# Altium schematic sheet DIN-rail AC-DC 24V.SchDoc
size A4; SheetNumber: 1; SheetTotal: 1
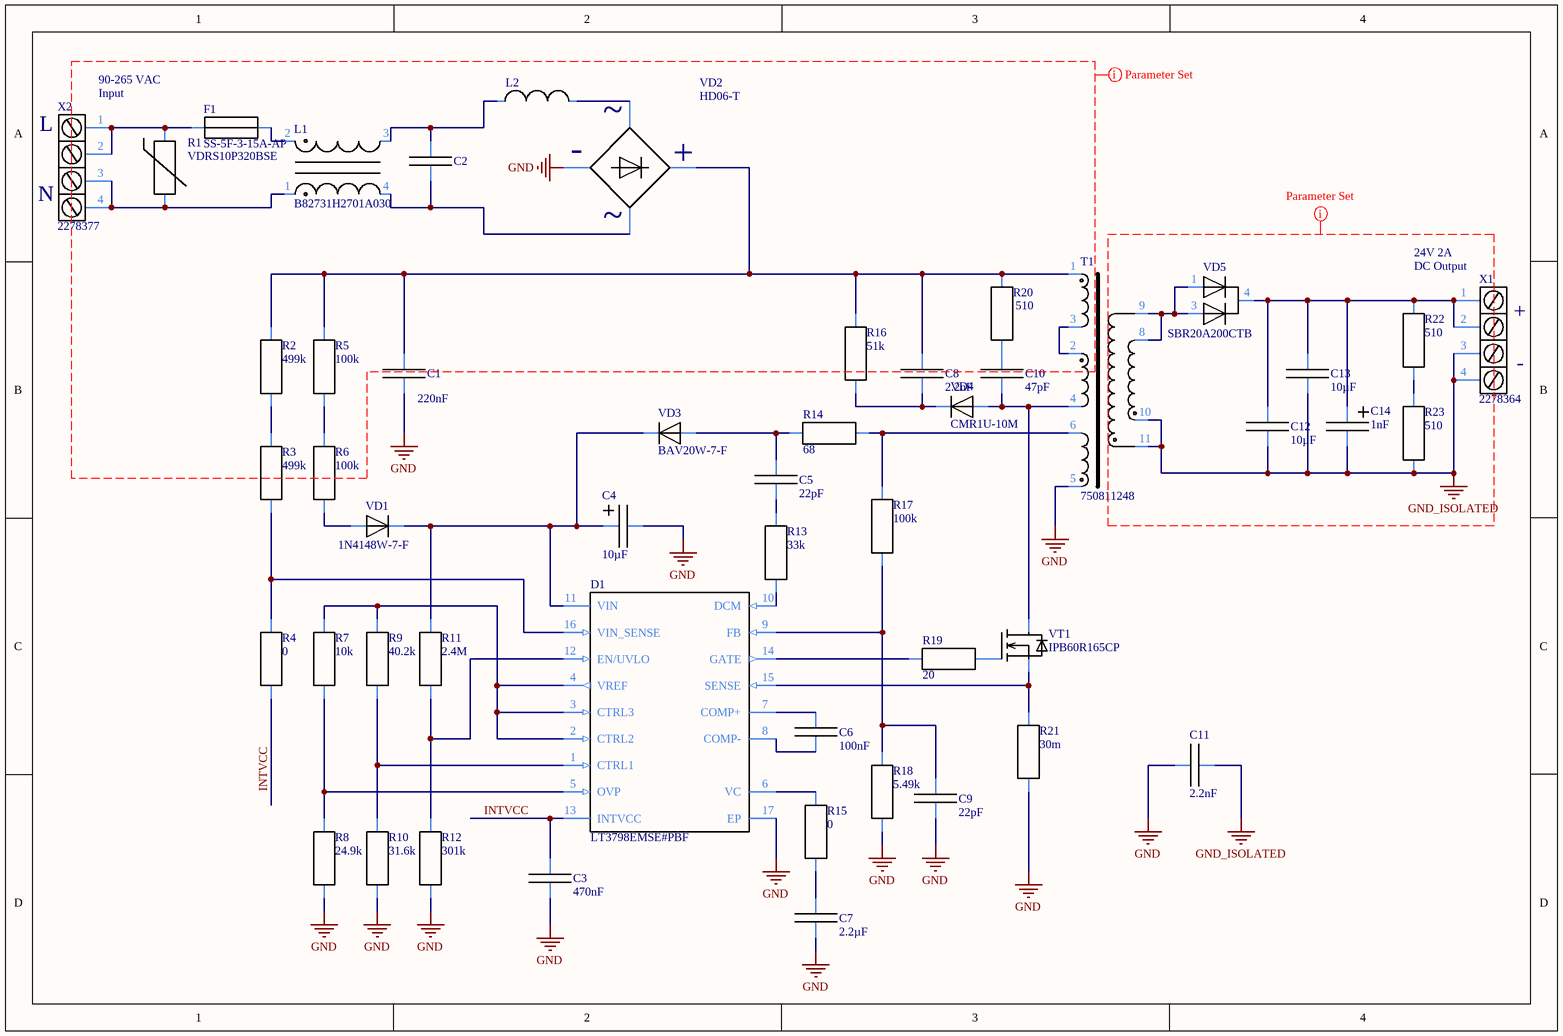
[diagram p0: DIN-rail AC-DC 24V.SchDoc]

## Parts
C1  Capacitance: 220nF  [ECQE4224XF]  (hidden comment: ECQE4224KF)
C2  ECQUAAF104M  [ECUAAF104]  (value not drawn)
C3  Capacitance: 470nF  [C0805]  (hidden comment: 0805YD475MAT2A)
C4  Capacitance: 10µF  [CAPPRD200W60D500H1100]  (hidden comment: 50YXJ10M5X11)
C5  Capacitance: 22pF  [C0805]  (hidden comment: 08055A220CAT2A)
C6  Capacitance: 100nF  [C0805]  (hidden comment: C2012X7R1H104K)
C7  Capacitance: 2.2µF  [C0805]  (hidden comment: C2012X5R1H225K)
C8  Capacitance: 2.2nF  [C1210]  (hidden comment: GRM32A7U2J222JW31D)
C9  Capacitance: 22pF  [C0805]  (hidden comment: 08055A220CAT2A)
C10  Capacitance: 47pF  [C1206]  (hidden comment: 1206CA470KAT1A)
C11  Capacitance: 2.2nF  [40LD22]  (hidden comment: 440LD22-R)
C12  Capacitance: 10µF  [C1210]  (hidden comment: GRM32ER7YA106KA12L)
C13  Capacitance: 10µF  [C1210]  (hidden comment: GRM32ER7YA106KA12L)
C14  Capacitance: 1nF  [CAPPRD500W60D1250H3000_1]  (hidden comment: ELXY350ETD102MK30S)
D1  LT3798EMSE#PBF  [SOP17P50_403X490X110L53X22T284X165]
F1  SS-5F-3-15A-AP  [SS-5F]
L1  B82731H2701A030  [B82731H]
L2  TSL1315RA-102JR78-PF  [TSL1315]  (value not drawn)
R1  VDRS10P320BSE  [VDRS10P320]
R2  Resistance: 499k  [R1206]  (hidden comment: CRCW1206499KFKEA)
R3  Resistance: 499k  [R1206]  (hidden comment: CRCW1206499KFKEA)
R4  Resistance: 0  [R0805]  (hidden comment: CRCW08050000Z0EA)
R5  Resistance: 100k  [R1206]  (hidden comment: CRCW1206100KFKEA)
R6  Resistance: 100k  [R1206]  (hidden comment: CRCW1206100KFKEA)
R7  Resistance: 10k  [R0805]  (hidden comment: CRCW080510K0FKEA)
R8  Resistance: 24.9k  [R0805]  (hidden comment: CRCW080524K9FKEA)
R9  Resistance: 40.2k  [R0805]  (hidden comment: CRCW080540K2FKEA)
R10  Resistance: 31.6k  [R0805]  (hidden comment: CRCW080531K6FKEA)
R11  Resistance: 2.4M  [R0805]  (hidden comment: CRCW08052M40JNEA)
R12  Resistance: 301k  [R0805]  (hidden comment: CRCW0805301KFKEA)
R13  Resistance: 33k  [R0805]  (hidden comment: CRCW080533K0JNEA)
R14  Resistance: 68  [R0805]  (hidden comment: CRCW080568R0FKEA)
R15  Resistance: 0  [R0805]  (hidden comment: CRCW08050000Z0EA)
R16  Resistance: 51k  [R1210]  (hidden comment: CRCW121051K0JNEA)
R17  Resistance: 100k  [R0805]  (hidden comment: CRCW0805100KFKEA)
R18  Resistance: 5.49k  [R0805]  (hidden comment: CRCW08055K49FKEA)
R19  Resistance: 20  [R0805]  (hidden comment: CRCW080520R0FKEA)
R20  Resistance: 510  [R1210]  (hidden comment: CRCW1210510RJNEA)
R21  Resistance: 30m  [R1206]  (hidden comment: WSL1206R0300FEA)
R22  Resistance: 510  [R1210]  (hidden comment: CRCW1210510RJNEA)
R23  Resistance: 510  [R1210]  (hidden comment: CRCW1210510RJNEA)
T1  750811248  [750811248]
VD1  1N4148W-7-F  [SOD-123]
VD2  HD06-T  [SOIC250P600X300-4L]
VD3  BAV20W-7-F  [SOD-123]
VD4  CMR1U-10M  [SMA]
VD5  SBR20A200CTB  [D2PAK]
VT1  IPB60R165CP  [D2PAK]
X1  2278364  [MCO 1,5_4-G1L-3,5 KMGY]
X2  2278377  [MCO 1,5_4-G1R-3,5 KMGY]

## Nets
GND: C1.2 C3.1 C4.2 C7.1 C9.2 C11.1 D1.17(EP) R8.1 R10.1 R12.1 R18.2 R21.1 T1.5 VD2.2
GND_ISOLATED: C11.2 C12.1 C13.1 C14.2 R23.1 T1.10 T1.11 X1.3 X1.4
INTVCC: C3.2 D1.13(INTVCC) R4.2
NetC1_1: C1.1 C8.2 R2.1 R5.1 R16.2 R20.2 T1.1 VD2.1
NetC2_1: C2.1 L1.4 VD2.4
NetC2_2: C2.2 L1.3 L2.1
NetC4_1: C4.1 D1.11(VIN) R11.2 VD1.2 VD3.2
NetC5_1: C5.1 R13.2
NetC5_2: C5.2 R14.1 VD3.1
NetC6_1: C6.1 D1.7(COMP+)
NetC6_2: C6.2 D1.8(COMP-)
NetC7_2: C7.2 R15.1
NetC8_1: C8.1 R16.1 VD4.2
NetC9_1: C9.1 D1.9(FB) R17.2 R18.1
NetC10_1: C10.1 T1.4 VD4.1 VT1.4
NetC10_2: C10.2 R20.1
NetC12_2: C12.2 C13.2 C14.1 R22.2 VD5.4 X1.1 X1.2
NetD1_1: D1.1(CTRL1) R9.1 R10.2
NetD1_2: D1.2(CTRL2) D1.3(CTRL3) D1.4(VREF) R7.2 R9.2
NetD1_5: D1.5(OVP) R7.1 R8.2
NetD1_6: D1.6(VC) R15.2
NetD1_10: D1.10(DCM) R13.1
NetD1_12: D1.12(EN/UVLO) R11.1 R12.2
NetD1_14: D1.14(GATE) R19.1
NetD1_15: D1.15(SENSE) R21.2 VT1.3
NetD1_16: D1.16(VIN_SENSE) R3.2 R4.1
NetF1_1: F1.1 R1.2 X2.1 X2.2
NetF1_2: F1.2 L1.2
NetL1_1: L1.1 R1.1 X2.3 X2.4
NetL2_2: L2.2 VD2.3
NetR2_2: R2.2 R3.1
NetR5_2: R5.2 R6.1
NetR6_2: R6.2 VD1.1
NetR14_2: R14.2 R17.1 T1.6
NetR19_2: R19.2 VT1.1
NetR22_1: R22.1 R23.2
NetT1_2: T1.2 T1.3
NetT1_8: T1.8 T1.9 VD5.1 VD5.3

## Layout directives
net class HV: GND
net class Secondary: GND_ISOLATED

## Notes on the sheet
- 90-265 VAC
- (near X2) Input
- (near X2) L
- (near X2) N
- 24V 2A
- DC Output
- (near X1) +
- (near X1) -
- (in symbol CMP-00022-2) ~; +

## Library data of the parts
C1 = CMP-00002-6: Film Capacitor, Polyester, 400V, 10% +Tol, 10% -Tol, 0.22uF, Through Hole Mount; Temp H: 105°C; Temp L: -40°C; Tolerance: 10%; Series: ECQE; Voltage: 400V; Dielectric: Polyester
C2 = CMP-00001-5: Film Capacitor, Polypropylene, 20% +Tol, 20% -Tol, 0.1uF, Through Hole Mount; Capacitance: 100nF; Temp L: -40°C; Voltage: 275V; Temp H: 110°C; Tolerance: 20%; Dielectric: Polypropylene; Series: ECQUA
C3 = CMP-00008-3: Ceramic Capacitor, Multilayer, Ceramic, 16V, 20% +Tol, 20% -Tol, X5R, 15% TC, 4.7uF, Surface Mount, 0805; Temp L: -55°C; Temp H: 85°C; Dielectric: X5R; Tolerance: 20%; Series: -; Voltage: 16V
C4 = CMP-00003-3: Aluminum Electrolytic Capacitor, Polarized, Aluminum (wet), 50V, 20% +Tol, 20% -Tol, 10uF, Through Hole Mount; Temp H: 105°C; Dielectric: Al oxide; Temp L: -40°C; Voltage: 50V; Series: YXJ; Tolerance: 20%
C5 C9 = CMP-00005-2: Ceramic Capacitor, Ceramic, 50V, 1.1364% +Tol, 1.1364% -Tol, C0G, -/+30ppm/Cel TC, 0.000022uF, 0805; Dielectric: NP0; Temp H: 125°C; Temp L: -55°C; Voltage: 50V; Series: -
C6 = CMP-00006-4: Ceramic Capacitor, Multilayer, Ceramic, 50V, 10% +Tol, 10% -Tol, X7R, 15% TC, 0.1uF, Surface Mount, 0805; Temp H: 125°C; Temp L: -55°C; Voltage: 50V; Series: C; Tolerance: 10%; Dielectric: X7R
C7 = CMP-00007-3: Cap Ceramic 2.2uF 50V X5R 10% SMD 0805 85C T/R; Temp H: 85°C; Temp L: -55°C; Voltage: 50V; Series: C; Tolerance: 10%; Dielectric: X5R
C8 = CMP-00000-3: Ceramic Capacitor, Multilayer, Ceramic, 630V, 5% +Tol, 5% -Tol, U2J, -750+/-120ppm/Cel TC, 0.0022uF, Surface Mount, 1210; Temp L: -55°C; Temp H: 125°C; Voltage: 630V; Dielectric: U2J; Series: GRM; Tolerance: 5%
C10 = CMP-00011-1: Ceramic Capacitor, Multilayer, Ceramic, 630V, 10% +Tol, 10% -Tol, C0G, 30ppm/Cel TC, 0.000047uF, Surface Mount, 1206; Dielectric: NP0; Temp L: -55°C; Temp H: 125°C; Tolerance: 10%; Voltage: 630V; Series: -
C11 = CMP-00004-1: Ceramic Capacitor, Ceramic, 20% +Tol, 20% -Tol, Y5U, -56/+22% TC, 0.0022uF, Through Hole Mount; Temp H: 125°C; Voltage: 760V; Temp L: -30°C; Dielectric: Y5U; Series: Cera-Mite 440L; Tolerance: 20%
C12 C13 = CMP-00010-1: Ceramic Capacitor, Multilayer, Ceramic, 35V, 10% +Tol, 10% -Tol, X7R, 15% TC, 10uF, Surface Mount, 1210; Temp L: -55°C; Tolerance: 20%; Temp H: 125°C; Dielectric: X7R; Series: GRM; Voltage: 35V
C14 = CMP-00009-4: Aluminum Electrolytic Capacitor, Polarized, Aluminum (wet), 35V, 20% +Tol, 20% -Tol, 1000uF, Through Hole Mount; Dielectric: Al oxide; Temp H: 105°C; Temp L: -55°C; Voltage: 35V; Tolerance: 20%; Series: LXY
D1 = CMP-00048-2: Power Factor Controller, Current-mode, 150kHz Switching Freq-Max, BIPolar, PDSO16; Temp L: 125°C; Temp H: -40°C
F1 = CMP-00049-1: Electric Fuse; Temp H: -40°C; Current: 3.15A; Temp L: 85°C; Series: SS-5F
L1 = CMP-00018-3: General Purpose Inductor, 27000uH, 50%, 2 Element, Ferrite-Core; Inductance: 27mH; Temp L: -40°C; Voltage: 250V; Current: 700mA; Temp H: 125°C; Series: B82731
L2 = CMP-00019-1: General Purpose Inductor, 1000uH, 5%, 1 Element; Temp H: 85°C; Current: 780mA; Temp L: -20°C; Inductance: 1mH; Tolerance: 5%; Series: TSL
R1 = CMP-00047-1: Varistor, 420V, 77J, Through Hole Mount; Current: 2.5kA; Energy: 77; Temp L: -40°C; Temp H: 85°C; Voltage: 510V; Series: VDRS
R2 R3 = CMP-00037-1: Fixed Resistor, Metal Glaze/thick Film, 0.25W, 499000ohm, 200V, 1% +/-Tol, 100ppm/Cel, Surface Mount, 1206; Temp L: -55°C; Temp Coeff: ±100ppm; Power: 250mW; Temp H: 155°C; Composition: Thik Film; Series: CRCW; Tolerance: 1%
R4 R15 = CMP-00040-1: Fixed Resistor, Metal Glaze/thick Film, 0.125W, 0ohm, Surface Mount, 0805; Power: 125mW; Temp L: -55°C; Temp H: 155°C; Tolerance: 0%; Temp Coeff: -; Composition: Thick Film; Series: CRCW
R5 R6 = CMP-00016-3: Fixed Resistor, Metal Glaze/thick Film, 0.25W, 100000ohm, 200V, 1% +/-Tol, 100ppm/Cel, Surface Mount, 1206; Temp L: -55°C; Temp Coeff: ±100ppm; Temp H: 155°C; Power: 250mW; Composition: Thik Film; Tolerance: 1%; Series: CRCW
R7 = CMP-00041-1: Fixed Resistor, Metal Glaze/thick Film, 0.125W, 10000ohm, 150V, 1% +/-Tol, 100ppm/Cel, Surface Mount, 0805; Temp Coeff: ±100ppm; Power: 125mW; Temp H: 155°C; Temp L: -55°C; Series: CRCW; Composition: Thick Film; Tolerance: 1%
R8 = CMP-00045-1: Fixed Resistor, Metal Glaze/thick Film, 0.125W, 24900ohm, 150V, 1% +/-Tol, 100ppm/Cel, Surface Mount, 0805; Power: 125mW; Temp L: -55°C; Temp Coeff: ±100ppm; Temp H: 155°C; Series: CRCW; Tolerance: 1%; Composition: Thick Film
R9 = CMP-00042-1: Fixed Resistor, Metal Glaze/thick Film, 0.125W, 40200ohm, 150V, 1% +/-Tol, 100ppm/Cel, Surface Mount, 0805; Temp L: -55°C; Power: 125mW; Temp Coeff: ±100ppm; Temp H: 155°C; Tolerance: 1%; Composition: Thick Film; Series: CRCW
R10 = CMP-00043-1: Fixed Resistor, Metal Glaze/thick Film, 0.125W, 31600ohm, 150V, 1% +/-Tol, 100ppm/Cel, Surface Mount, 0805; Power: 125mW; Temp H: 155°C; Temp Coeff: ±100ppm; Temp L: -55°C; Series: CRCW; Tolerance: 1%; Composition: Thick Film
R11 = CMP-00039-1: Fixed Resistor, Metal Glaze/thick Film, 0.125W, 2400000ohm, 150V, 5% +/-Tol, 200ppm/Cel, Surface Mount, 0805; Temp L: -55°C; Temp Coeff: ±200ppm; Temp H: 155°C; Power: 125mW; Tolerance: 5%; Composition: Thick Film; Series: CRCW
R12 = CMP-00044-1: Fixed Resistor, Metal Glaze/thick Film, 0.125W, 301000ohm, 150V, 1% +/-Tol, 100ppm/Cel, Surface Mount, 0805; Temp L: -55°C; Temp H: 155°C; Temp Coeff: ±100ppm; Power: 125mW; Tolerance: 1%; Series: CRCW; Composition: Thick Film
R13 = CMP-00033-1: Fixed Resistor, Metal Glaze/thick Film, 0.125W, 33000ohm, 150V, 5% +/-Tol, 200ppm/Cel, Surface Mount, 0805; Temp L: -55°C; Power: 125mW; Temp H: 155°C; Temp Coeff: ±200ppm; Composition: Thick Film; Tolerance: 5%; Series: CRCW
R14 = CMP-00030-1: Fixed Resistor, Metal Glaze/thick Film, 0.125W, 68ohm, 150V, 1% +/-Tol, 100ppm/Cel, Surface Mount, 0805; Temp L: -55°C; Temp H: 155°C; Temp Coeff: ±100ppm; Power: 125mW; Tolerance: 1%; Composition: Thick Film; Series: CRCW
R16 = CMP-00038-1: Fixed Resistor, Metal Glaze/thick Film, 0.5W, 51000ohm, 200V, 5% +/-Tol, 200ppm/Cel, Surface Mount, 1210; Temp H: 155°C; Temp Coeff: ±200ppm; Temp L: -55°C; Power: 500mW; Composition: Thik Film; Tolerance: 5%; Series: CRCW
R17 = CMP-00020-3: Fixed Resistor, Metal Glaze/thick Film, 0.25W, 100000ohm, 200V, 1% +/-Tol, 100ppm/Cel, Surface Mount, 1206; Temp Coeff: ±100ppm; Temp L: -55°C; Temp H: 155°C; Power: 125mW; Series: CRCW; Tolerance: 1%; Composition: Thik Film
R18 = CMP-00021-2: Fixed Resistor, Metal Glaze/thick Film, 0.125W, 5490ohm, 150V, 1% +/-Tol, 100ppm/Cel, Surface Mount, 0805; Temp L: -55°C; Temp H: 155°C; Temp Coeff: ±100ppm; Power: 125mW; Tolerance: 1%; Composition: Thick Film; Series: CRCW
R19 = CMP-00032-1: Fixed Resistor, Metal Glaze/thick Film, 0.125W, 20ohm, 150V, 1% +/-Tol, 100ppm/Cel, Surface Mount, 0805; Temp Coeff: ±100ppm; Power: 125mW; Temp L: -55°C; Temp H: 155°C; Series: CRCW; Tolerance: 1%; Composition: Thick Film
R20 R22 R23 = CMP-00035-1: Fixed Resistor, Metal Glaze/thick Film, 0.5W, 510ohm, 200V, 5% +/-Tol, 200ppm/Cel, Surface Mount, 1210; Temp L: -55°C; Temp Coeff: ±200ppm; Power: 500mW; Temp H: 155°C; Tolerance: 5%; Composition: Thik Film; Series: CRCW
R21 = CMP-00034-1: Fixed Resistor, Metal Strip, 0.25W, 0.03ohm, 0.0866V, 1% +/-Tol, 75ppm/Cel, Surface Mount, 1206; Temp Coeff: ±75ppm; Temp H: 170°C; Power: 250mW; Temp L: -60°C; Series: CRCW; Tolerance: 1%; Composition: Metal Element
T1 = CMP-00025-1: Datacom Transformer; Temp L: -40°C; Temp H: 125°C; Transformer Type: DATACOM TRANSFORMER
VD1 = CMP-00015-1: Rectifier Diode, 1 Phase, 1 Element, 0.15A, 100V V(RRM), Silicon; Temp H: 150°C; Temp L: -65°C; Current: 300mA; Series: -; Reverse Voltage: 100V
VD2 = CMP-00022-2: Bridge Rectifier Diode, 1 Phase, 0.8A, 600V V(RRM), Silicon; Temp H: 150°C; Current: 800mA; Temp L: -55°C; Series: -; Reverse Voltage: 600V
VD3 = CMP-00013-1: Rectifier Diode, 1 Phase, 1 Element, 0.4A, 150V V(RRM), Silicon; Temp H: 150°C; Current: 200mA; Temp L: -65°C; Series: -; Reverse Voltage: 150V
VD4 = CMP-00012-1: Rectifier Diode, 1 Phase, 1 Element, 1A, 1000V V(RRM); Temp L: -65°C; Temp H: 175°C; Reverse Voltage: 1kV; Series: -; Current: 1A
VD5 = CMP-00014-1: Rectifier Diode, 1 Phase, 2 Element, 20A, 200V V(RRM), Silicon, TO-263AB; Temp H: 175°C; Current: 10A; Temp L: -65°C; Series: SBR; Reverse Voltage: 200V
VT1 = CMP-00017-1: Power Field-Effect Transistor, 21A I(D), 600V, 0.165ohm, 1-Element, N-Channel, Silicon, Metal-oxide Semiconductor FET, TO-263AB; Temp L: -55°C; Temp H: 150°C; Power: 192W; FET type: N-Channel; Vdss: 600V; Current: 21A; Series: CoolMOS
X1 = CMP-00051-1: Barrier Strip Terminal Block; Current: 8A; Voltage: 320V; Series: COMBICON MCO; PinCount: 4
X2 = CMP-00050-1: Strip Terminal Block, 8A, 1 Row(s), 1 Deck(s); Voltage: 320V; PinCount: 4; Current: 8A; Series: COMBICON MCO